# Altium project 收发器V2.0.PrjPcb
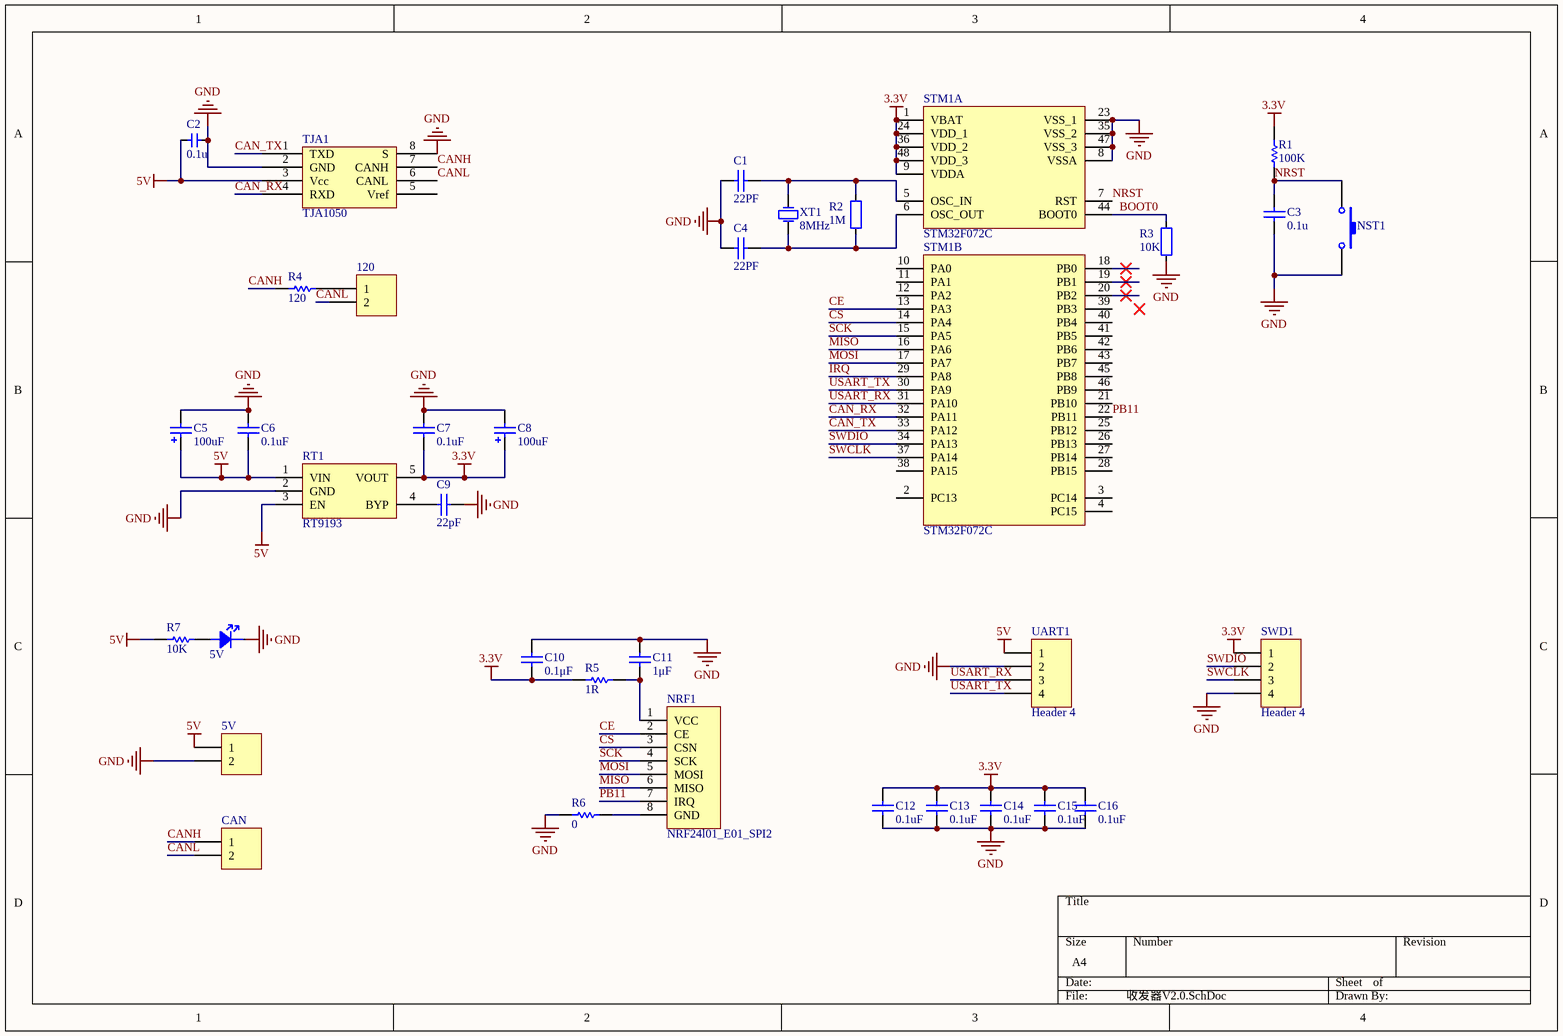
[diagram p0: 收发器V2.0.SchDoc]
1 sheet, 35 parts. Net scope: global (net labels, ports and power ports of the same name join across sheets).
Board file: 收发器V2.0.PcbDoc

## Sheet 收发器V2.0.SchDoc
size A4

### Parts
(Parts that share a designator on the sheet are numbered #1, #2 ... from top to bottom, then left to right.)
5V#1  lED  [0805D]  (value not drawn)
5V#2  Header 2  [XH-2.54PIN2]  (value not drawn)
120  Header 2  [SIP2]  (value not drawn)
C1  value 22PF  [CAP-MLCC-0603]  (hidden comment: CAP)
C2  value 0.1u  [CAP-MLCC-0603]  (hidden comment: Cap_0603)
C3  0.1u  [CAP-MLCC-0603]
C4  value 22PF  [CAP-MLCC-0603]  (hidden comment: CAP)
C5  value 100uF  [6032C]  (hidden comment: Cap Pol3)
C6  value 0.1uF  [CAP-MLCC-0603]  (hidden comment: Cap)
C7  value 0.1uF  [CAP-MLCC-0603]  (hidden comment: Cap)
C8  value 100uF  [6032C]  (hidden comment: Cap Pol3)
C9  value 22pF  [CAP-MLCC-0603]  (hidden comment: Cap)
C10  0.1μF  [CAP-MLCC-0603]
C11  1μF  [CAP-MLCC-0603]
C12  value 0.1uF  [CAP-MLCC-0603]  (hidden comment: Cap)
C13  value 0.1uF  [CAP-MLCC-0603]  (hidden comment: Cap)
C14  value 0.1uF  [CAP-MLCC-0603]  (hidden comment: Cap)
C15  value 0.1uF  [CAP-MLCC-0603]  (hidden comment: Cap)
C16  value 0.1uF  [CAP-MLCC-0603]  (hidden comment: Cap)
CAN  Header 2  [Green_2P]  (value not drawn)
NRF1  NRF24l01_E01_SPI2  [E01-ML01SP2]
NST1  SW-PB  [KEY]  (value not drawn)
R1  value 100K  [RES-0603]  (hidden comment: RES)
R2  value 1M  [RES_0603]  (hidden comment: Res_0603)
R3  value 10K  [RES-0603]  (hidden comment: Res_0603)
R4  value 120  [RES-0603]  (hidden comment: Res1)
R5  value 1R  [RES-0603]  (hidden comment: Res1)
R6  value 0  [RES-0603]  (hidden comment: Res1)
R7  value 10K  [RES-0603]  (hidden comment: Res1)
RT1  RT9193  [SOT23-5]
STM1  STM32F072C  [LQFP_P0.5_48]  (parts A,B of 2)
SWD1  Header 4  [HDR1X4]
TJA1  TJA1050  [TJA1050]
UART1  Header 4  [HDR1X4]
XT1  value 8MHz  [Osc-6032]  (hidden comment: XTAL_3225_2P)

### Nets
3.3V: C7.1 C8.1 C10.1 C12.2 C13.2 C14.2 C15.2 C16.2 R1.2 R5.1 RT1.5(VOUT) STM1.1(VBAT) STM1.9(VDDA) STM1.24(VDD_1) STM1.36(VDD_2) STM1.48(VDD_3) SWD1.1
5V: 5V#2.1 C2.1 C5.1 C6.1 R7.2 RT1.1(VIN) RT1.3(EN) TJA1.3(Vcc) UART1.1
GND: 5V#1.K 5V#2.2 C1.1 C2.2 C3.1 C4.1 C5.2 C6.2 C7.2 C8.2 C9.2 C10.2 C11.2 C12.1 C13.1 C14.1 C15.1 C16.1 NST1.2 R3.1 R6.1 RT1.2(GND) STM1.8(VSSA) STM1.23(VSS_1) STM1.35(VSS_2) STM1.47(VSS_3) SWD1.4 TJA1.2(GND) TJA1.8(S) UART1.2
BOOT0: R3.2 STM1.44(BOOT0)
CAN_RX: STM1.32(PA11) TJA1.4(RXD)
CAN_TX: STM1.33(PA12) TJA1.1(TXD)
CANH: CAN.1 R4.2 TJA1.7(CANH)
CANL: 120.2 CAN.2 TJA1.6(CANL)
CE: NRF1.2(CE) STM1.13(PA3)
CS: NRF1.3(CSN) STM1.14(PA4)
IRQ: STM1.29(PA8)
MISO: NRF1.6(MISO) STM1.16(PA6)
MOSI: NRF1.5(MOSI) STM1.17(PA7)
NRST: C3.2 NST1.1 R1.1 STM1.7(RST)
PB11: NRF1.7(IRQ) STM1.22(PB11)
SCK: NRF1.4(SCK) STM1.15(PA5)
SWCLK: STM1.37(PA14) SWD1.3
SWDIO: STM1.34(PA13) SWD1.2
USART_RX: STM1.31(PA10) UART1.3
USART_TX: STM1.30(PA9) UART1.4
Net5V#1_A: 5V#1.A R7.1
Net120_1: 120.1 R4.1
NetC1_2: C1.2 R2.2 STM1.5(OSC_IN) XT1.2(OSC2)
NetC4_2: C4.2 R2.1 STM1.6(OSC_OUT) XT1.1(OSC1)
NetC9_1: C9.1 RT1.4(BYP)
NetC11_1: C11.1 NRF1.1(VCC) R5.2
NetNRF1_8: NRF1.8(GND) R6.2

Not connected (* = marked no-connect by the designer): STM1 2(PC13) 3(PC14) 4(PC15) 10(PA0) 11(PA1) 12(PA2) 18(PB0)* 19(PB1)* 20(PB2)* 21(PB10) 25(PB12) 26(PB13) 27(PB14) 28(PB15) 38(PA15) 39(PB3) 40(PB4) 41(PB5) 42(PB6) 43(PB7) 45(PB8) 46(PB9); TJA1 5(Vref)

### Library data of the parts
5V#1 = 00-D-LED
5V#2 120 CAN = Header 2: Header, 2-Pin; LatestRevisionDate: 17-Jul-2002; LatestRevisionNote: Re-released for DXP Platform.; Publisher: Altium Limited
C1 C4 = CAP: 无极性电容; Published: 8-Jun-2000; LatestRevisionDate: 17-Jul-2002; LatestRevisionNote: Re-released for DXP Platform.; PackageReference: RAD-0.3; Publisher: Altium Limited; PackageDescription: Radial Cap, Thru-Hole; 2 Leads; 0.3 in Pin Spacing
C2 = Cap_0603: Capacitor
C3 C10 C11 = CAP: 无极性电容; Value: *μF; Published: 8-Jun-2000; LatestRevisionDate: 17-Jul-2002; LatestRevisionNote: Re-released for DXP Platform.; PackageReference: RAD-0.3; Publisher: Altium Limited; PackageDescription: Radial Cap, Thru-Hole; 2 Leads; 0.3 in Pin Spacing
C5 C8 = Cap Pol3: Polarized Capacitor (Surface Mount); Published: 8-Jun-2000; LatestRevisionDate: 17-Jul-2002; LatestRevisionNote: Re-released for DXP Platform.; PackageReference: C0805; Publisher: Altium Limited
C6 C7 C9 C12-C16 = Cap: Capacitor; Published: 8-Jun-2000; LatestRevisionDate: 17-Jul-2002; LatestRevisionNote: Re-released for DXP Platform.; PackageReference: RAD-0.3; Publisher: Altium Limited
NST1 = SW-PB: Switch; Published: 24-Mar-1999; LatestRevisionDate: 17-Jul-2002; LatestRevisionNote: Re-released for DXP Platform.; PackageReference: SPST-2; Publisher: Altium Limited; PackageDescription: Switch; 2 Leads
R1 = RES: 电阻; Published: 8-Jun-2000; LatestRevisionDate: 17-Jul-2002; LatestRevisionNote: Re-released for DXP Platform.; PackageReference: AXIAL-0.3; Publisher: Altium Limited; PackageDescription: Axial Device, Thru-Hole; 2 Leads; 0.3 in Pin Spacing
R2 R3 = Res_0603: Resistor
R4-R7 = Res1: Resistor; Published: 8-Jun-2000; LatestRevisionDate: 17-Jul-2002; LatestRevisionNote: Re-released for DXP Platform.; PackageReference: AXIAL-0.3; Publisher: Altium Limited
RT1 = RT9193: Power
STM1 = STM32F103C: MCU
SWD1 UART1 = Header 4: Header, 4-Pin; LatestRevisionDate: 17-Jul-2002; LatestRevisionNote: Re-released for DXP Platform.; Publisher: Altium Limited
TJA1 = TJA1050: CAN总线收发器
XT1 = XTAL_3225_2P: Crystal Oscillator